# Altium schematic sheet trsv_main.SchDoc: mcHF Pro Transceiver UI board
size A3; Author: Krassi Atanassov; CompanyName: MØNKA; Engineer: For radio amateurs experimentation, non-commercial use only. Thank you!; Revision: 0.9.0; SheetTotal: 7
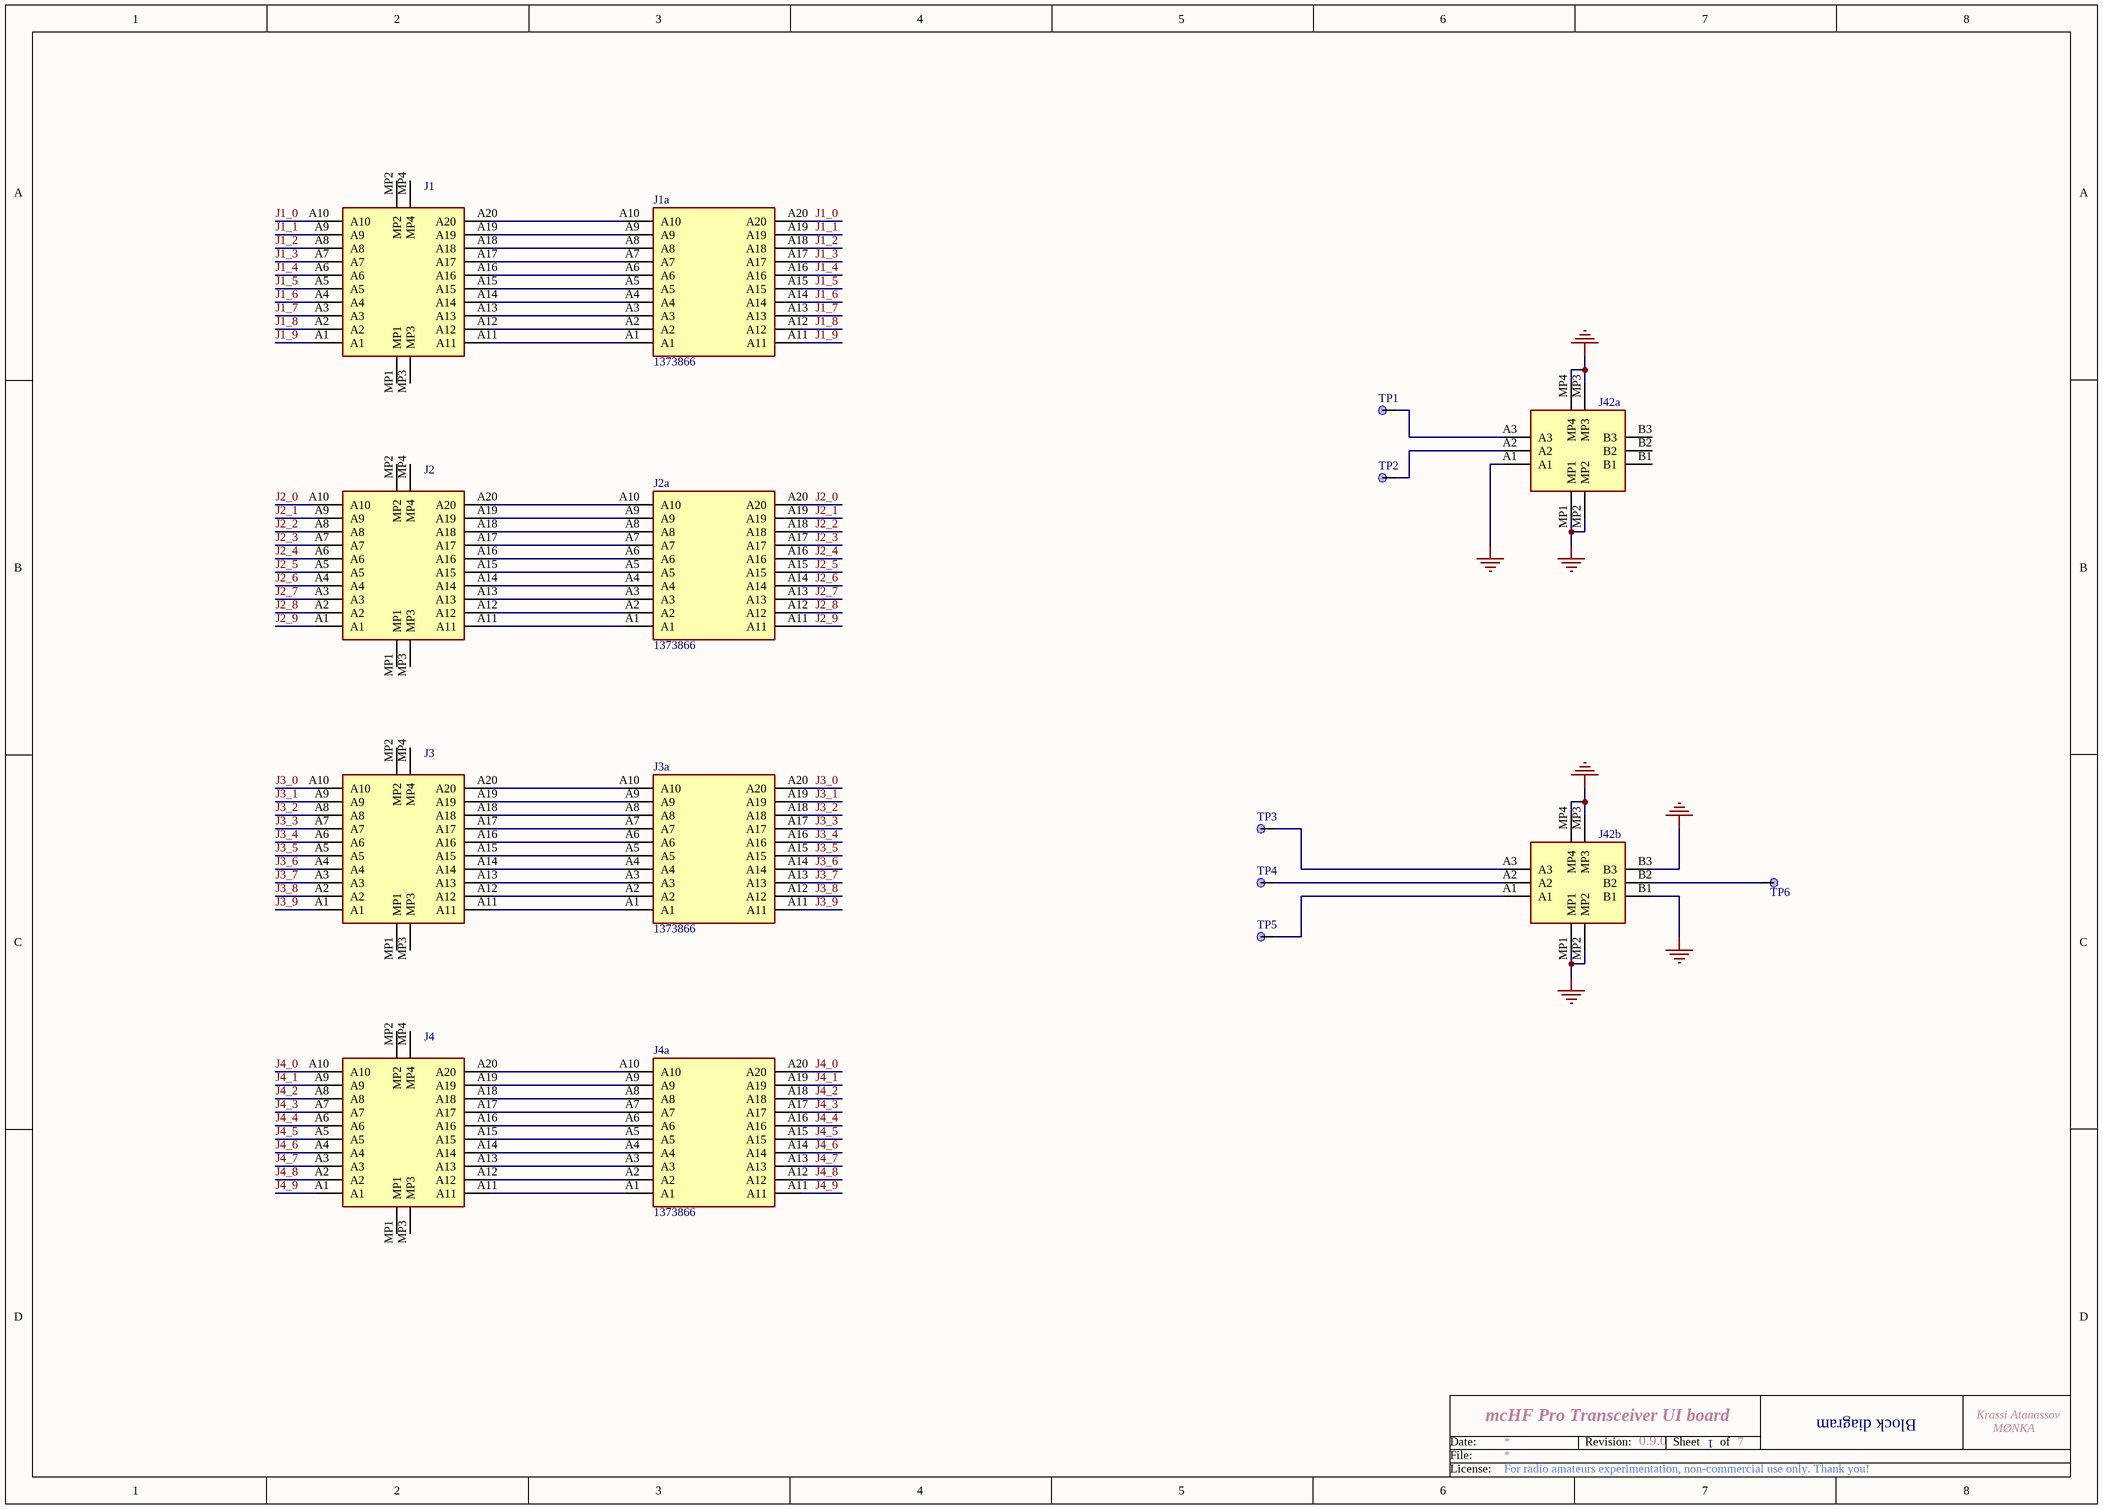
[diagram p0: trsv_main.SchDoc]

## Parts
J1  1373866  [1373866]  (value not drawn)
J1a  1373866  [YuanQi4mm]
J2  1373866  [1373866]  (value not drawn)
J2a  1373866  [YuanQi4mm]
J3  1373866  [1373866]  (value not drawn)
J3a  1373866  [YuanQi4mm]
J4  1373866  [1373866]  (value not drawn)
J4a  1373866  [YuanQi4mm]
J42a  1373826  [1373826]  (value not drawn)
J42b  1373826  [1373826]  (value not drawn)
TP1  TP  [TP]  (value not drawn)
TP2  TP  [TP]  (value not drawn)
TP3  TP  [TP]  (value not drawn)
TP4  TP  [TP]  (value not drawn)
TP5  TP  [TP]  (value not drawn)
TP6  TP  [TP]  (value not drawn)

## Nets
GND: J42a.A1 J42a.MP1 J42a.MP2 J42a.MP3 J42a.MP4 J42b.B1 J42b.B3 J42b.MP1 J42b.MP2 J42b.MP3 J42b.MP4
J1_0: J1.A10 J1a.A20
J1_1: J1.A9 J1a.A19
J1_2: J1.A8 J1a.A18
J1_3: J1.A7 J1a.A17
J1_4: J1.A6 J1a.A16
J1_5: J1.A5 J1a.A15
J1_6: J1.A4 J1a.A14
J1_7: J1.A3 J1a.A13
J1_8: J1.A2 J1a.A12
J1_9: J1.A1 J1a.A11
J2_0: J2.A10 J2a.A20
J2_1: J2.A9 J2a.A19
J2_2: J2.A8 J2a.A18
J2_3: J2.A7 J2a.A17
J2_4: J2.A6 J2a.A16
J2_5: J2.A5 J2a.A15
J2_6: J2.A4 J2a.A14
J2_7: J2.A3 J2a.A13
J2_8: J2.A2 J2a.A12
J2_9: J2.A1 J2a.A11
J3_0: J3.A10 J3a.A20
J3_1: J3.A9 J3a.A19
J3_2: J3.A8 J3a.A18
J3_3: J3.A7 J3a.A17
J3_4: J3.A6 J3a.A16
J3_5: J3.A5 J3a.A15
J3_6: J3.A4 J3a.A14
J3_7: J3.A3 J3a.A13
J3_8: J3.A2 J3a.A12
J3_9: J3.A1 J3a.A11
J4_0: J4.A10 J4a.A20
J4_1: J4.A9 J4a.A19
J4_2: J4.A8 J4a.A18
J4_3: J4.A7 J4a.A17
J4_4: J4.A6 J4a.A16
J4_5: J4.A5 J4a.A15
J4_6: J4.A4 J4a.A14
J4_7: J4.A3 J4a.A13
J4_8: J4.A2 J4a.A12
J4_9: J4.A1 J4a.A11
NetJ1_A11: J1.A11 J1a.A1
NetJ1_A12: J1.A12 J1a.A2
NetJ1_A13: J1.A13 J1a.A3
NetJ1_A14: J1.A14 J1a.A4
NetJ1_A15: J1.A15 J1a.A5
NetJ1_A16: J1.A16 J1a.A6
NetJ1_A17: J1.A17 J1a.A7
NetJ1_A18: J1.A18 J1a.A8
NetJ1_A19: J1.A19 J1a.A9
NetJ1_A20: J1.A20 J1a.A10
NetJ2_A11: J2.A11 J2a.A1
NetJ2_A12: J2.A12 J2a.A2
NetJ2_A13: J2.A13 J2a.A3
NetJ2_A14: J2.A14 J2a.A4
NetJ2_A15: J2.A15 J2a.A5
NetJ2_A16: J2.A16 J2a.A6
NetJ2_A17: J2.A17 J2a.A7
NetJ2_A18: J2.A18 J2a.A8
NetJ2_A19: J2.A19 J2a.A9
NetJ2_A20: J2.A20 J2a.A10
NetJ3_A11: J3.A11 J3a.A1
NetJ3_A12: J3.A12 J3a.A2
NetJ3_A13: J3.A13 J3a.A3
NetJ3_A14: J3.A14 J3a.A4
NetJ3_A15: J3.A15 J3a.A5
NetJ3_A16: J3.A16 J3a.A6
NetJ3_A17: J3.A17 J3a.A7
NetJ3_A18: J3.A18 J3a.A8
NetJ3_A19: J3.A19 J3a.A9
NetJ3_A20: J3.A20 J3a.A10
NetJ4_A11: J4.A11 J4a.A1
NetJ4_A12: J4.A12 J4a.A2
NetJ4_A13: J4.A13 J4a.A3
NetJ4_A14: J4.A14 J4a.A4
NetJ4_A15: J4.A15 J4a.A5
NetJ4_A16: J4.A16 J4a.A6
NetJ4_A17: J4.A17 J4a.A7
NetJ4_A18: J4.A18 J4a.A8
NetJ4_A19: J4.A19 J4a.A9
NetJ4_A20: J4.A20 J4a.A10
NetJ42a_A2: J42a.A2 TP2.1
NetJ42a_A3: J42a.A3 TP1.1
NetJ42b_A1: J42b.A1 TP5.1
NetJ42b_A2: J42b.A2 TP4.1
NetJ42b_A3: J42b.A3 TP3.1
NetJ42b_B2: J42b.B2 TP6.1

Not connected (* = marked no-connect by the designer): J1 MP1 MP2 MP3 MP4; J2 MP1 MP2 MP3 MP4; J3 MP1 MP2 MP3 MP4; J4 MP1 MP2 MP3 MP4; J42a B1 B2 B3

## Notes on the sheet
- 1
- Block diagram
- Date:
- File:
- Revision:
- Sheet
- of
- License:

## Library data of the parts
J1-J4 = 1373866: SMD male connector, nominal current: 2.2 A, Test voltage: 840 VAC, number of positions: 20, pitch: 1.27 mm, color: black, contact surface: Gold, type of contact: Male connector, mounting: SMD soldering; Manufacturer_Name: Phoenix Contact; Geometry.Height: 6.75mm; Mouser Part Number: 651-1373866; Mouser Price/Stock: https://www.mouser.co.uk/ProductDetail/Phoenix-Contact/1373866?qs=2SLPxufLcgAs0enIXKjUUw%3D%3D; Manufacturer_Part_Number: 1373866; Datasheet Link: http://www.phoenixcontact.com/gb/produkte/1373866
J1a J2a J3a J4a = YQ_20p: SMD male connector, nominal current: 2.2 A, Test voltage: 840 VAC, number of positions: 20, pitch: 1.27 mm, color: black, contact surface: Gold, type of contact: Male connector, mounting: SMD soldering; Manufacturer_Name: Phoenix Contact; Geometry.Height: 6.75mm; Mouser Part Number: 651-1373866; Mouser Price/Stock: https://www.mouser.co.uk/ProductDetail/Phoenix-Contact/1373866?qs=2SLPxufLcgAs0enIXKjUUw%3D%3D; Manufacturer_Part_Number: 1373866; Datasheet Link: http://www.phoenixcontact.com/gb/produkte/1373866
J42a J42b = 1373826: SMD male connector, nominal current: 2.2 A, Test voltage: 840 VAC, number of positions: 6, pitch: 1.27 mm, color: black, contact surface: Gold, type of contact: Male connector, mounting: SMD soldering; Manufacturer_Name: Phoenix Contact; Geometry.Height: 6.75mm; Mouser Part Number: 651-1373826; Mouser Price/Stock: https://www.mouser.co.uk/ProductDetail/Phoenix-Contact/1373826?qs=2SLPxufLcgB13Clq%252BEBMrA%3D%3D; Manufacturer_Part_Number: 1373826; Datasheet Link: http://www.phoenixcontact.com/gb/produkte/1373826